# Altium project Arduino_UNO_28pin.PrjPcb
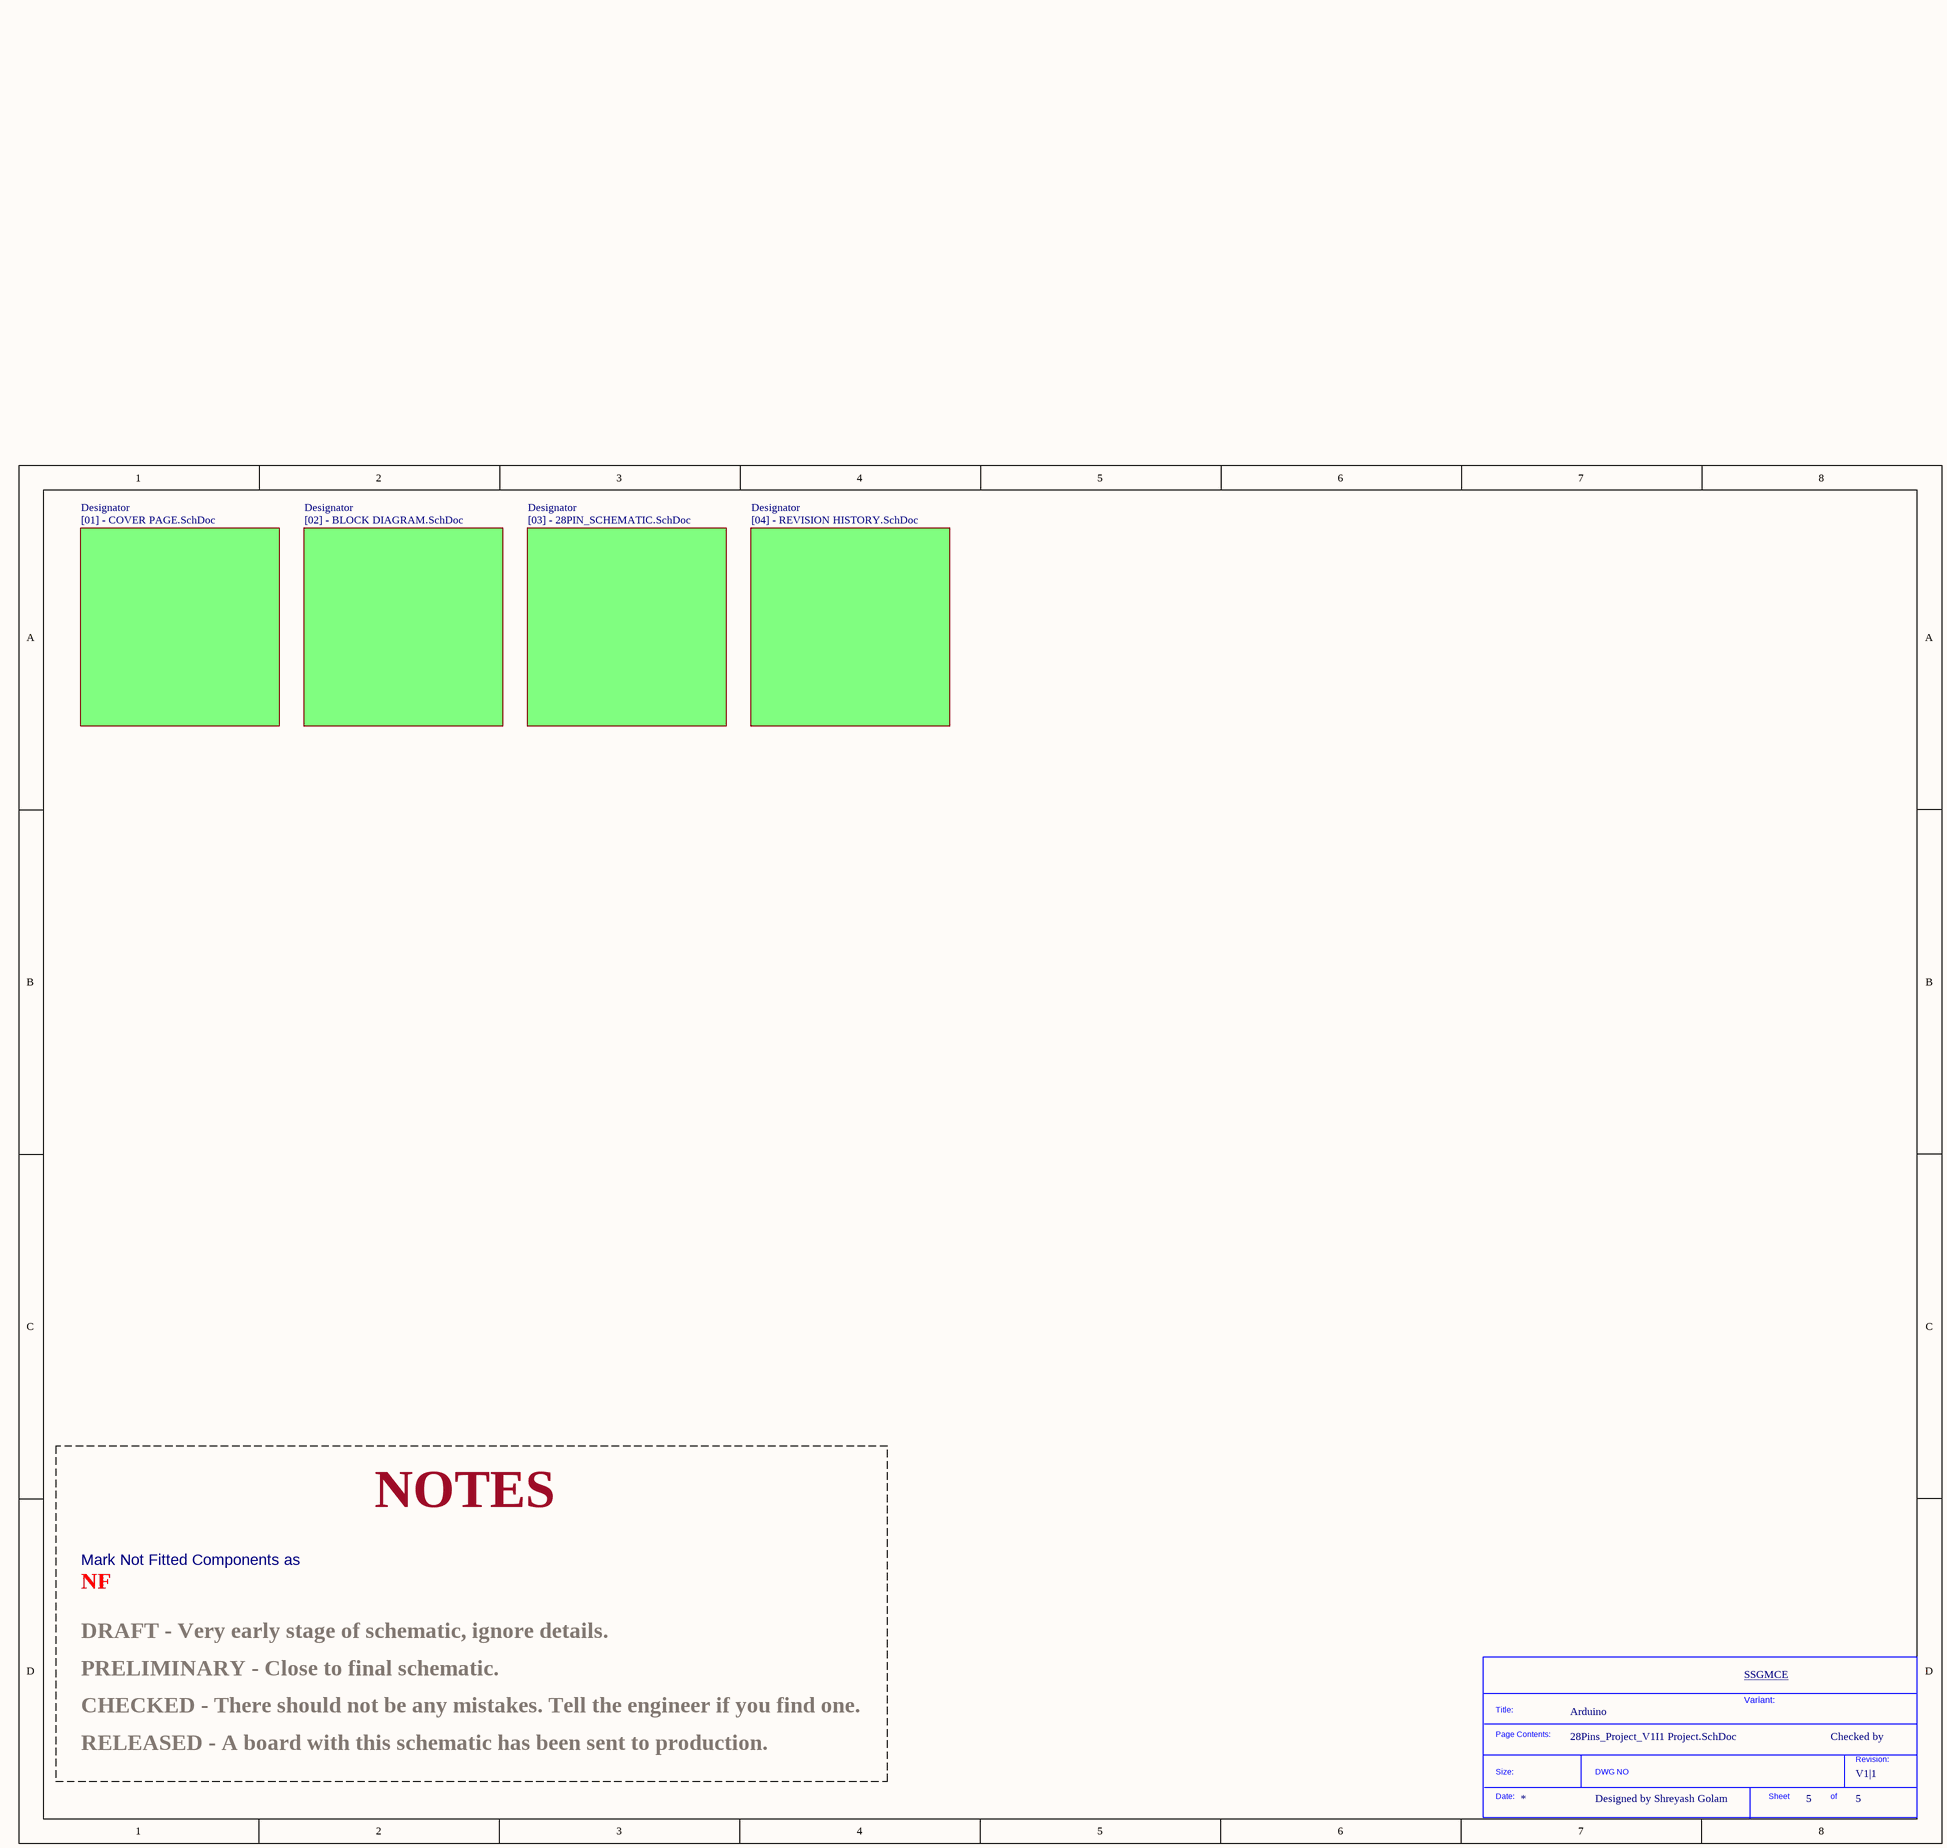
[diagram p0: 28Pins_Project_V1I1 Project.SchDoc]
CheckedBy: Mr. K. T. Kahar; CompanyName: SSGMCE; DesignedBy: Designed By Shreyash Golam; Project: Arduino; Title: Arduino_UNO_28pin; Variant: UNO R3; VersionRevision: V1|1
1 sheet, 1 parts. Net scope: global (net labels, ports and power ports of the same name join across sheets).
Board file: 28pin_PCB.PcbDoc

## Sheet 28Pins_Project_V1I1 Project.SchDoc: Arduino_UNO_28pin
size A3; DocumentNumber: 5; SheetNumber: 5; SheetTotal: 5; PageSetup: Record=PageOptions|CenterHorizontal=True|CenterVertical=True|PrintScale=1.07|XCorrection=1.00|YCorrection=1.00|PrintKind=1|BorderSize=5000000|LeftOffset=0|BottomOffset=0|Orientation=2|PaperLength=1000|PaperWidth=1000|Scale=100|PaperSource=7|PrintQuality=600|MediaType=1|DitherType=10|PaperKind=A3|PrintScaleMode=1

### Parts
*  SDTitleBlock  (value not drawn)  (graphical)

### Sub-sheets
Designator = [01] - COVER PAGE.SchDoc (file not in this document): no entries
Designator = [02] - BLOCK DIAGRAM.SchDoc (file not in this document): no entries
Designator = [04] - REVISION HISTORY.SchDoc (file not in this document): no entries
Designator = [03] - 28PIN_SCHEMATIC.SchDoc (file not in this document): no entries

### Notes on the sheet
- NOTES
- NF
- Mark Not Fitted Components as
- PRELIMINARY - Close to final schematic.
- DRAFT - Very early stage of schematic, ignore details.
- SSGMCE
- CHECKED - There should not be any mistakes. Tell the engineer if you find one.
- Variant:
- Checked by
- RELEASED - A board with this schematic has been sent to production.
- Designed by Shreyash Golam
- (in symbol SDTitleBlock) Title:; Page Contents:; Revision:; Size:; DWG NO; Date:; Sheet; of

## Assembly variants
Fixed 5V: not fitted J1 J17 R8 R20
5V/3V3: not fitted J1 R8 R19 R20; alternate parts Y1 -> Crystal_8MHz, Y2 -> Crystal_10MHz